# Altium schematic sheet 410_H_BRIDGE_CORE.SchDoc
size A2; SheetNumber: 5; SheetTotal: 5
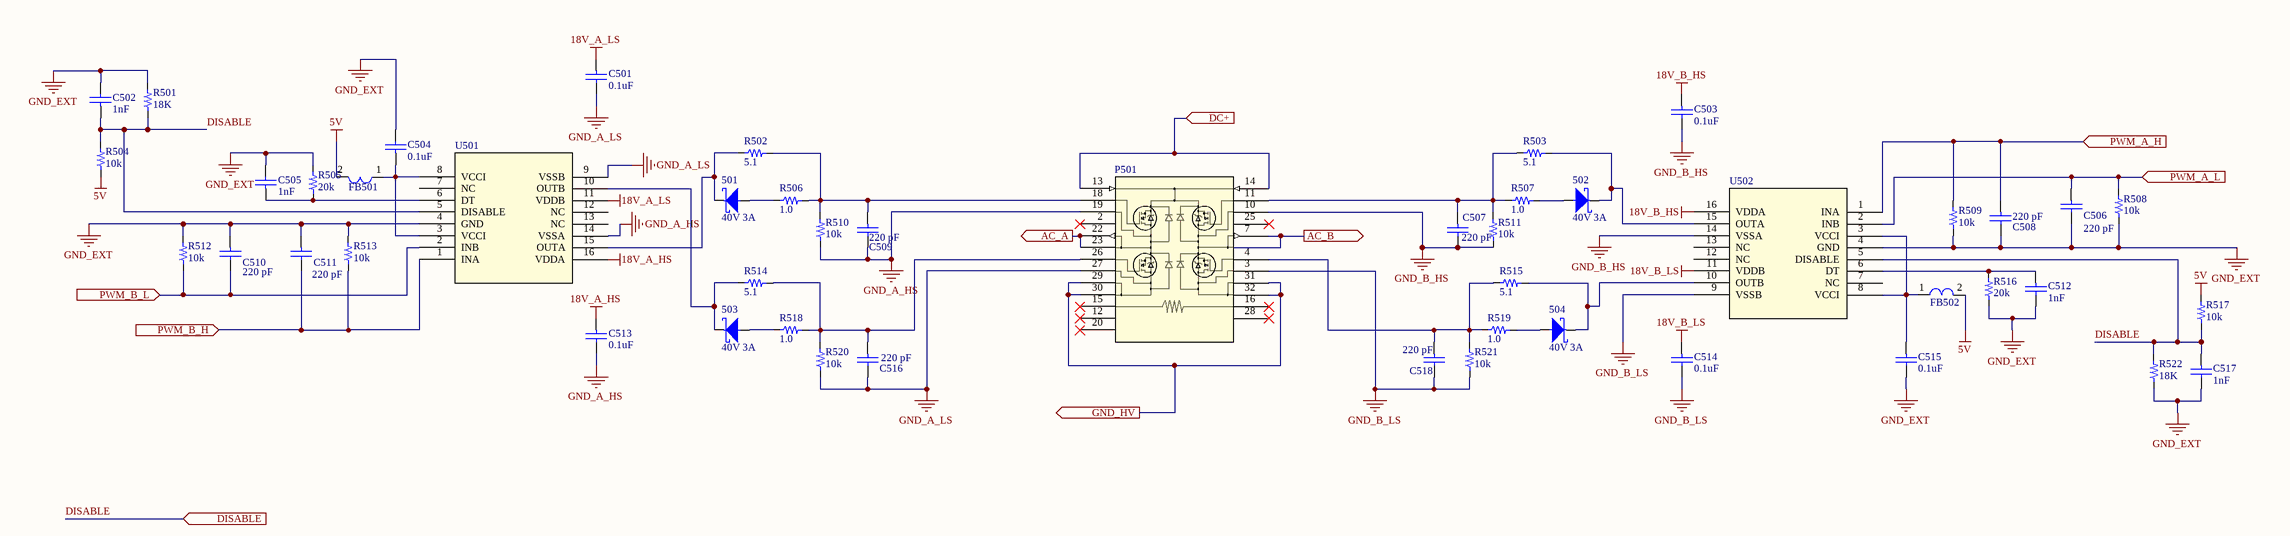
[diagram p0: 410_H_BRIDGE_CORE.SchDoc]

## Parts
501  40V 3A  [SMA]
502  40V 3A  [SMA]
503  40V 3A  [SMA]
504  40V 3A  [SMA]
C501  value 0.1uF  [0603_cap]
C502  value 1nF  [0603_cap]
C503  0.1uF  [0603_cap]
C504  value 0.1uF  [0603_cap]
C505  value 1nF  [0603_cap]
C506  220 pF  [0603_cap]
C507  220 pF  [0603_cap]
C508  220 pF  [0603_cap]
C509  220 pF  [0603_cap]
C510  220 pF  [0603_cap]
C511  220 pF  [0603_cap]
C512  value 1nF  [0603_cap]
C513  value 0.1uF  [0603_cap]
C514  value 0.1uF  [0603_cap]
C515  value 0.1uF  [0603_cap]
C516  220 pF  [0603_cap]
C517  value 1nF  [0603_cap]  (hidden comment: 1nF 50V)
C518  220 pF  [0603_cap]
FB501  (no value)  [MH1608]
FB502  (no value)  [MH1608]
P501  (no value)  [SP3F_MCH]
R501  18K  [0603_res]
R502  value 5.1  [0603_res]
R503  value 5.1  [0603_res]
R504  value 10k  [0603_res]
R505  20k  [0603_res]
R506  1.0  [0603_res]
R507  1.0  [0603_res]
R508  value 10k  [0603_res]
R509  value 10k  [0603_res]
R510  value 10k  [0603_res]
R511  value 10k  [0603_res]
R512  value 10k  [0603_res]
R513  value 10k  [0603_res]
R514  value 5.1  [0603_res]
R515  value 5.1  [0603_res]
R516  20k  [0603_res]
R517  value 10k  [0603_res]
R518  1.0  [0603_res]
R519  1.0  [0603_res]
R520  value 10k  [0603_res]
R521  value 10k  [0603_res]
R522  18K  [0603_res]
U501  (no value)  [UCC21540DW]
U502  (no value)  [UCC21540DW]

## Ports
AC_A (out), AC_B (out), DC+ (in), DISABLE (in), GND_HV (out), PWM_A_H (in), PWM_A_L (in), PWM_B_H (in), PWM_B_L (in)

## Nets
5V: FB501.2 FB502.2 R504.1 R517.2
18V_A_HS: C513.1 U501.16(VDDA)
18V_A_LS: C501.1 U501.11(VDDB)
18V_B_HS: C503.1 U502.16(VDDA)
18V_B_LS: C514.1 U502.11(VDDB)
GND_A_HS: C509.2 C513.2 P501.19 R510.1 U501.14(VSSA)
GND_A_LS: C501.2 C516.2 P501.27 R520.1 U501.9(VSSB)
GND_B_HS: C503.2 C507.2 P501.10 R511.1 U502.14(VSSA)
GND_B_LS: C514.2 C518.2 P501.3 R521.1 U502.9(VSSB)
GND_EXT: C502.2 C504.2 C505.2 C506.2 C508.2 C510.1 C511.1 C512.2 C515.2 C517.2 R501.2 R505.2 R508.1 R509.1 R512.2 R513.2 R516.1 R522.1 U501.4(GND) U502.4(GND)
AC_A: P501.22 P501.23 ; port AC_A
AC_B: P501.7 ; port AC_B
DC+: P501.13 P501.14 ; port DC+
DISABLE: C502.1 C517.1 R501.1 R504.2 R517.1 R522.2 U501.5(DISABLE) U502.5(DISABLE) ; port DISABLE
GND_HV: P501.29 P501.30 P501.31 P501.32 ; port GND_HV
PWM_A_H: C508.1 R509.2 U502.1(INA) ; port PWM_A_H
PWM_A_L: C506.1 R508.2 U502.2(INB) ; port PWM_A_L
PWM_B_H: C511.2 R513.1 U501.1(INA) ; port PWM_B_H
PWM_B_L: C510.2 R512.1 U501.2(INB) ; port PWM_B_L
Net501_1: 501.1 R502.1 U501.15(OUTA)
Net501_2: 501.2 R506.1
Net502_1: 502.1 R503.2 U502.15(OUTA)
Net502_2: 502.2 R507.2
Net503_1: 503.1 R514.1 U501.10(OUTB)
Net503_2: 503.2 R518.1
Net504_1: 504.1 R515.2 U502.10(OUTB)
Net504_2: 504.2 R519.2
NetC504_1: C504.1 FB501.1 U501.3(VCCI) U501.8(VCCI)
NetC505_1: C505.1 R505.1 U501.6(DT)
NetC507_1: C507.1 P501.11 R503.1 R507.1 R511.2
NetC509_1: C509.1 P501.18 R502.2 R506.2 R510.2
NetC512_1: C512.1 R516.2 U502.6(DT)
NetC515_1: C515.1 FB502.1 U502.3(VCCI) U502.8(VCCI)
NetC516_1: C516.1 P501.26 R514.2 R518.2 R520.2
NetC518_1: C518.1 P501.4 R515.1 R519.1 R521.2

Not connected (* = marked no-connect by the designer): P501 2* 12* 15* 16* 20* 25* 28*; U501 7(NC) 12(NC) 13(NC); U502 7(NC) 12(NC) 13(NC)

## Library data of the parts
501-504 = D_Schottky_40V_3A_SMA: 40V Independent 3A 550mV@3A SMA Schottky Diodes ROHS; Manufacturer: TDSEMIC; Manufacturer Part Number: SS34-TD; Supplier 1: LCSC; Supplier Part Number 1: C46550832; ComponentLink1Description: LCSC; ComponentLink1URL: https://lcsc.com/product-detail/Schottky-Diodes_TDSEMIC-SS34-TD_C46550832.html
C501 C504 C513-C515 = Cap_0.1uF_0603_50V: 50V 100nF Y5V -20%~+80% 0603 Multilayer Ceramic Capacitors MLCC - SMD/SMT ROHS; Manufacturer: Walsin Tech Corp; Manufacturer Part Number: 0603F104Z500CT; Supplier 1: LCSC; Supplier Part Number 1: C83060; ComponentLink1Description: LCSC; ComponentLink1URL: https://www.lcsc.com/product-detail/Multilayer-Ceramic-Capacitors-MLCC-SMD-SMT_Walsin-Tech-Corp-0603F104Z500CT_C83060.html
C502 C505 C512 C517 = Cap_1nF_0603_50V: 50V 1nF X7R ±10% 0603 Multilayer Ceramic Capacitors MLCC - SMD/SMT ROHS; Manufacturer: YAGEO; Manufacturer Part Number: CC0603KRX7R9BB102; Supplier 1: LCSC; Supplier Part Number 1: C100040; ComponentLink1Description: LCSC; ComponentLink1URL: https://www.lcsc.com/product-detail/Multilayer-Ceramic-Capacitors-MLCC-SMD-SMT_YAGEO-CC0603KRX7R9BB102_C100040.html
C503 = Cap_0.1uF_0603_50V: CAP CER 100nF 50V Y5V 0603; Manufacturer: FOJAN; Manufacturer Part Number: FCC0603F104Z500CT; Supplier 1: LCSC; Supplier Part Number 1: C5137469; ComponentLink1Description: LCSC; ComponentLink1URL: https://www.lcsc.com/product-detail/C5137469.html?s_z=n_q_0603F104Z500CT&spm=wm.fly.bg.2.xh&lcsc_vid=Q1QLUFRRTgRfUVdSQAVWUgVQT1JdUlwFE1MMV1EEQgAxVlNRTlhfUFBXRlRXUTsOAxUeFF5JWBYZEEoKFBINSQcJGk4eFQsCAgIaSgADAwAHC0slTldfUldfWQkaCgg%3D; Value: 0.1uF
C506-C511 C516 C518 = CAP CER_220PF_50V_X7R_0603: CAP CER 220pF 50V X7R 0603; Manufacturer: Samsung Electro-Mechanics; Manufacturer Part Number: CL10B221KB8NNNC; Supplier 1: LCSC; Supplier Part Number 1: C1603; ComponentLink1Description: LCSC; ComponentLink1URL: https://www.lcsc.com/product-detail/C1603.html?spm=wm.fly.bg.0.xh&lcsc_vid=Q1QLUFRRTgRfUVdSQAVWUgVQT1JdUlwFE1MMV1EEQgAxVlNRTlhfUFFeRFBfXjsOAxUeFF5JWBYZEEoKFBINSQcJGk4NBhADEA4cHktXRlVcSQwSGg0%3D
FB501 FB502 = FERRITE_BEAD_600_OHM: FERRITE BEAD 600 OHM 0603 4LN; Manufacturer: Bourns Inc.; Manufacturer Part Number: MH1608-601Y; ComponentLink1Description: DigiKEy; ComponentLink1URL: https://www.digikey.com/en/products/detail/bourns-inc/MH1608-601Y/2563317; Supplier 1: DigiKey; Supplier Part Number 1: MH1608-601YCT-ND
P501 = MOSFET_4N-CH: MOSFET - Arreglos 1200V (1.2kV) 173H (Tc) 745W (Tc) Montaje de chasis SP3F; Manufacturer: Microchip Technology; Manufacturer Part Number: MSCSM120HM16CT3AG; ComponentLink1Description: JLCPCB; ComponentLink1URL: https://www.digikey.com/es/products/detail/microchip-technology/MSCSM120HM16CT3AG/12350281?s=N4IgTCBcDaILIGUDCC4EYwAYAS6BsSAKgMwCCA4iALoC%2BQA; Supplier 1: DigiKey; Supplier Part Number 1: 150-MSCSM120HM16CT3AG-ND
R501 R522 = RES_18K_OHM _0603: 18 kOhms ±5% 0.1W, 1/10W Resistencia en microprocesador 0603 (1608 métrico) Resistente a la humedad Película gruesa; Manufacturer: YAGEO; Manufacturer Part Number: RC0603JR-0718KL; ComponentLink1URL: https://www.lcsc.com/product-detail/C105575.html?s_z=n_q_RC0603FR-0720KL&spm=wm.fly.bg.0.xh&lcsc_vid=RQNdVwAEE1JbUldTTgAIXlFWQ1NYXlYETgNXUlBVFQMxVlNRTlReVV1VQVBaVDsOAxUeFF5JWBYZEEoKFBINSQcJGk4eFQsCAgIaSgADAwAHC0slRlBcVFRTWQkaCgg%3D; Supplier 1: LCSC; Supplier Part Number 1: C105575; ComponentLink1Description: LCSC
R502 R503 R514 R515 = RES_SMD_5.1_OHM_0603: 5.1 Ohms ±1% 0.125W, 1/8W Resistencia en microprocesador 0603 (1608 métrico) AEC-Q200 automotriz Película gruesa; Manufacturer: VISHAY; Manufacturer Part Number: CRCW06035R10FKEA; ComponentLink1URL: https://lcsc.com/product-detail/Chip-Resistor-Surface-Mount_YAGEO-RC0603FR-0754K9L_C185321.html; Supplier 1: LCSC; Supplier Part Number 1: C242492; ComponentLink1Description: LCSC
R504 R508-R513 R517 R520 R521 = Res_10k_0603_1/10W: RES SMD 10k OHM 5% 1/10W 0603; Manufacturer: FOJAN; Manufacturer Part Number: FRC0603J103TS; ComponentLink1URL: https://www.lcsc.com/product-detail/Chip-Resistor-Surface-Mount_FOJAN-FRC0603J103TS_C2930027.html; Supplier 1: LCSC; Supplier Part Number 1: C2930027; ComponentLink1Description: LCSC
R505 R516 = RES_20K_OHM_0603: RES 20kΩ ±1% 100mW 0603; Manufacturer: FOJAN; Manufacturer Part Number: FRC0603F2002TS; ComponentLink1URL: https://www.lcsc.com/product-detail/C2907011.html?s_z=n_q_t_resistor%252020k&spm=wm.fly.bg.0.xh___wm.ssy.tc.0.tz&lcsc_vid=Q1QLUFRRTgRfUVdSQAVWUgVQT1JdUlwFE1MMV1EEQgAxVlNRTlhfXldRRFJaUDsOAxUeFF5JWBYZEEoKFBINSQcJGk4dAgUUFAk%3D; Supplier 1: LCSC; Supplier Part Number 1: C2907011; ComponentLink1Description: LCSC; Value: 20k
R506 R507 R518 R519 = RES_1_OHM_0603: 1 Ohms ±1% 0.1W, 1/10W Resistencia en microprocesador 0603 (1608 métrico) Resistente a la humedad Película gruesa; Manufacturer: YAGEO; Manufacturer Part Number: RC0603FR-071RL; ComponentLink1URL: https://www.lcsc.com/product-detail/C112305.html?s_z=n_q_RC0603FR-071RL&spm=wm.fly.bg.0.xh&lcsc_vid=RQNdVwAEE1JbUldTTgAIXlFWQ1NYXlYETgNXUlBVFQMxVlNRTlReVVxSRVZcUDsOAxUeFF5JWBYZEEoKFBINSQcJGk4eFQsCAgIaSgADAwAHC0slRVVcU11UWQkaCgg%3D; Supplier 1: LCSC; Supplier Part Number 1: C112305; ComponentLink1Description: LCSC
U501 U502 = DGTL ISO 5.7KV 2CH GT DVR 16SOIC: 4A, 6A Controladores de compuerta Acoplamiento capacitivo 5700Vrms 2 canal 16-SOIC; Manufacturer: Texas Instruments; ComponentLink1Description: DigiKEy; ComponentLink1URL: https://www.digikey.com/es/products/detail/texas-instruments/UCC21540DW/9860890; Supplier 1: DigiKey; Supplier Part Number 1: 296-53088-ND; Manufacturer Part Number: UCC21540DW